# Altium schematic sheet CPU.SchDoc
size A; SheetNumber: 2; SheetTotal: 8
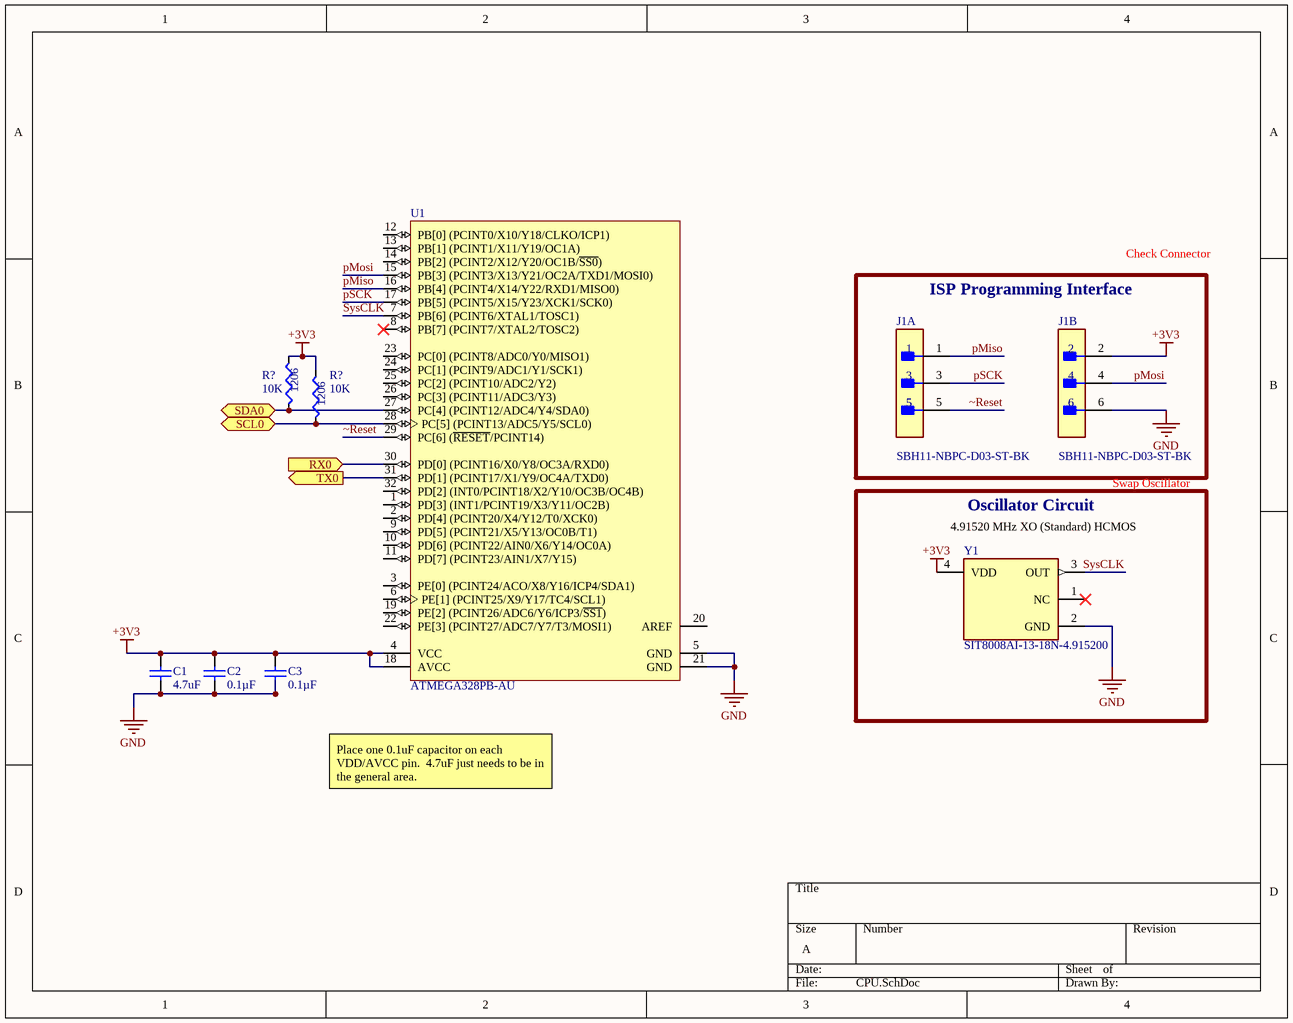
[diagram p0: CPU.SchDoc]

## Parts
(Parts that share a designator on the sheet are numbered #1, #2 ... from top to bottom, then left to right.)
C1  4.7uF  [C1206]
C2  0.1µF  [C0603]
C3  0.1µF  [C0603]
J1  SBH11-NBPC-D03-ST-BK  [FP-SBH11-NBPC-D03-ST-BK-MFG]  (parts A,B of 2)
R?#1  10K  [R1206]
R?#2  10K  [R1206]
U1  ATMEGA328PB-AU  [ATML-32A_L]
Y1  SIT8008AI-13-18N-4.915200  [FP-SIT8008-1-MFG]

## Blocks framed on the sheet
ISP Programming Interface: J1
Oscillator Circuit: Y1

## Ports
RX0 (in), SCL0 (bidir), SDA0 (bidir), TX0 (out)

## Nets
+3V3: C1.2 C2.2 C3.2 J1.2 R?#1.2 R?#2.2 U1.4(VCC) U1.18(AVCC) Y1.4(VDD)
GND: C1.1 C2.1 C3.1 J1.6 U1.5(GND) U1.21(GND) Y1.2(GND)
pMiso: J1.1 U1.16(PB[4]_(PCINT4/X14/Y22/RXD1/MISO0))
pMosi: J1.4 U1.15(PB[3]_(PCINT3/X13/Y21/OC2A/TXD1/MOSI0))
pSCK: J1.3 U1.17(PB[5]_(PCINT5/X15/Y23/XCK1/SCK0))
RX0: U1.30(PD[0]_(PCINT16/X0/Y8/OC3A/RXD0)) ; port RX0
SCL0: R?#2.1 U1.28(PC[5]_(PCINT13/ADC5/Y5/SCL0)) ; port SCL0
SDA0: R?#1.1 U1.27(PC[4]_(PCINT12/ADC4/Y4/SDA0)) ; port SDA0
SysCLK: U1.7(PB[6]_(PCINT6/XTAL1/TOSC1)) Y1.3(OUT)
TX0: U1.31(PD[1]_(PCINT17/X1/Y9/OC4A/TXD0)) ; port TX0
~Reset: J1.5 U1.29(PC[6]_(~{RESET}/PCINT14))

Not connected (* = marked no-connect by the designer): U1 1(PD[3]_(INT1/PCINT19/X3/Y11/OC2B)) 2(PD[4]_(PCINT20/X4/Y12/T0/XCK0)) 3(PE[0]_(PCINT24/ACO/X8/Y16/ICP4/SDA1)) 6(PE[1]_(PCINT25/X9/Y17/TC4/SCL1)) 8(PB[7]_(PCINT7/XTAL2/TOSC2))* 9(PD[5]_(PCINT21/X5/Y13/OC0B/T1)) 10(PD[6]_(PCINT22/AIN0/X6/Y14/OC0A)) 11(PD[7]_(PCINT23/AIN1/X7/Y15)) 12(PB[0]_(PCINT0/X10/Y18/CLKO/ICP1)) 13(PB[1]_(PCINT1/X11/Y19/OC1A)) 14(PB[2]_(PCINT2/X12/Y20/OC1B/~{SS0})) 19(PE[2]_(PCINT26/ADC6/Y6/ICP3/~{SS1})) 20(AREF) 22(PE[3]_(PCINT27/ADC7/Y7/T3/MOSI1)) 23(PC[0]_(PCINT8/ADC0/Y0/MISO1)) 24(PC[1]_(PCINT9/ADC1/Y1/SCK1)) 25(PC[2]_(PCINT10/ADC2/Y2)) 26(PC[3]_(PCINT11/ADC3/Y3)) 32(PD[2]_(INT0/PCINT18/X2/Y10/OC3B/OC4B)); Y1 1(NC)*

## Notes on the sheet
- Check Connector
- Swap Oscillator
- (near Y1) 4.91520 MHz XO (Standard) HCMOS
- Place one 0.1uF capacitor on each VDD/AVCC pin.  4.7uF just needs to be in the general area.
- (in symbol CMP-024-000007-3) 1206

## Library data of the parts
C1 = CL31B475KBHNNNE: CER 4.7uF 50V X7R 1206; Made By: Brennan Swanton; Reviewed By: Carter Allen; Supplier 1: Digi-Key; Supplier Part Number 1: 587-2994-1-ND
C2 C3 = ESD35C104K4T2A-24: CAP CER 0.1UF 50V X7R 0603; Made By: Brennan Swanton; Reviewed By: *; Supplier 1: Digi-Key; Supplier Part Number 1: 478-8009-1-ND
J1 = CMP-00595-33729071-1: SBH11-NBPC-D03-ST-BK Conn Header Vert 6POS 2.54MM; Number of Contacts: 6; Connector Type: Male Pin; Current Rating: 3A; Height: 9.3mm; Row Spacing: 2.54mm; NexarPartId: 33729071; Max Operating Temperature: 105°C; RoHS: Compliant; Color: Black; Termination: Solder; Mount: Through Hole; Contact Material: Gold, Nickel; Contact Plating: Gold; Number of Rows: 2; Min Operating Temperature: -40°C; Number of Positions: 6; Pitch: 2.54mm
R?#1 R?#2 = CMP-024-000007-3: RES SMD 10K OHM 0.1% 1/4W 1206; Made By: Rita Yang; Source: Resistors.SchLib; Design Item ID: ERA-8AEB103V
U1 = CMP-2000-07439-1: AVR Microcontroller, 1.8 to 5.5 V, 32 KB Flash, 1 KB EEPROM, 2 KB SRAM, -40 to 85 degC, 32-Pin TQFP (32A), RoHS, Tray; Manufacturer: Microchip; Datasheet URL: http://ww1.microchip.com/downloads/en/DeviceDoc/40001906A.pdf; Mounting Technology: SurfaceMount; RoHSCompliant: false; Manufacturer URL: http://www.microchip.com/; Package Description: 32-Pin Thin Profile Plastic Quad Flat Package, Body 7 x 7 mm, Pitch 0.8 mm; Package Reference: 32A; Datasheet Version: Rev. A, 04/2017
Y1 = CMP-25159-009738-1: 4.91520 MHz XO (Standard) HCMOS, LVCMOS Oscillator 1.8V No Connect 4-SMD, No Lead; Manufacturer: SiTime; Max Junction Temp: +150°C; Nominal Supply Current: 3.8mA; Min Supply Voltage: 1.62V; Max Supply Voltage: 1.98V; temperature_range: Industrial, -40 to 85°C; output_drive_strength: Default; frequency_stability: ±50 ppm; voltage_supply: 1.8 V ±10%; package_size: 2.5 x 2.0 mm; Temperature Range Low: -40°C; Category: Crys; Height: 0.8mm; Package: SIT8008-1; ComponentLink2Description: Datasheet; Manufacturer Part Number: SIT8008AI-13-18N-4.915200; revision: A; Frequency: 4.91520 MHz; Temperature: -40°C to +85°C; packaging: Bulk; feature_pin: No Connect; ComponentLink2URL: https://www.sitime.com/datasheet/SiT8008; RoHS: TRUE; Lead Free: Yes; Device Class L3: Timers and Oscillators; Octopart: https://octopart.com/sit8008ai-13-18n-4.915200-sitime-102635591; Automotive: No; Temperature Range High: +85°C; octopart_url: https://octopart.com/sit8008ai-13-18n-4.915200-sitime-102635591; Device Class L1: Integrated Circuits (ICs); Device Class L2: Clock and Timing; nominal_supply_voltage: 1.8V